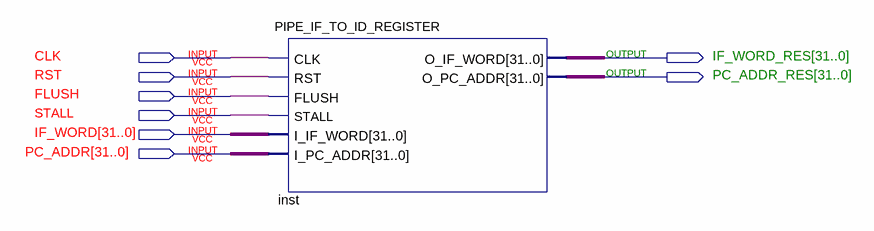
[diagram p0: schematic sheet]
// Quartus schematic PIPE_IF_TO_ID_REGISTERTEST.bdf as structural Verilog: 1 symbols, 8 pins
module PIPE_IF_TO_ID_REGISTERTEST (
  input  CLK,
  input  RST,
  input  FLUSH,
  input  STALL,
  input  [31:0] IF_WORD,
  input  [31:0] PC_ADDR,
  output [31:0] IF_WORD_RES,
  output [31:0] PC_ADDR_RES
);

  PIPE_IF_TO_ID_REGISTER inst (
    .CLK(CLK), .RST(RST), .FLUSH(FLUSH), .STALL(STALL), .I_IF_WORD(IF_WORD), .I_PC_ADDR(PC_ADDR),
    .O_IF_WORD(IF_WORD_RES), .O_PC_ADDR(PC_ADDR_RES));
endmodule
